# Altium schematic sheet ETH10M100_MAGNET_RJ45.SchDoc
size A3
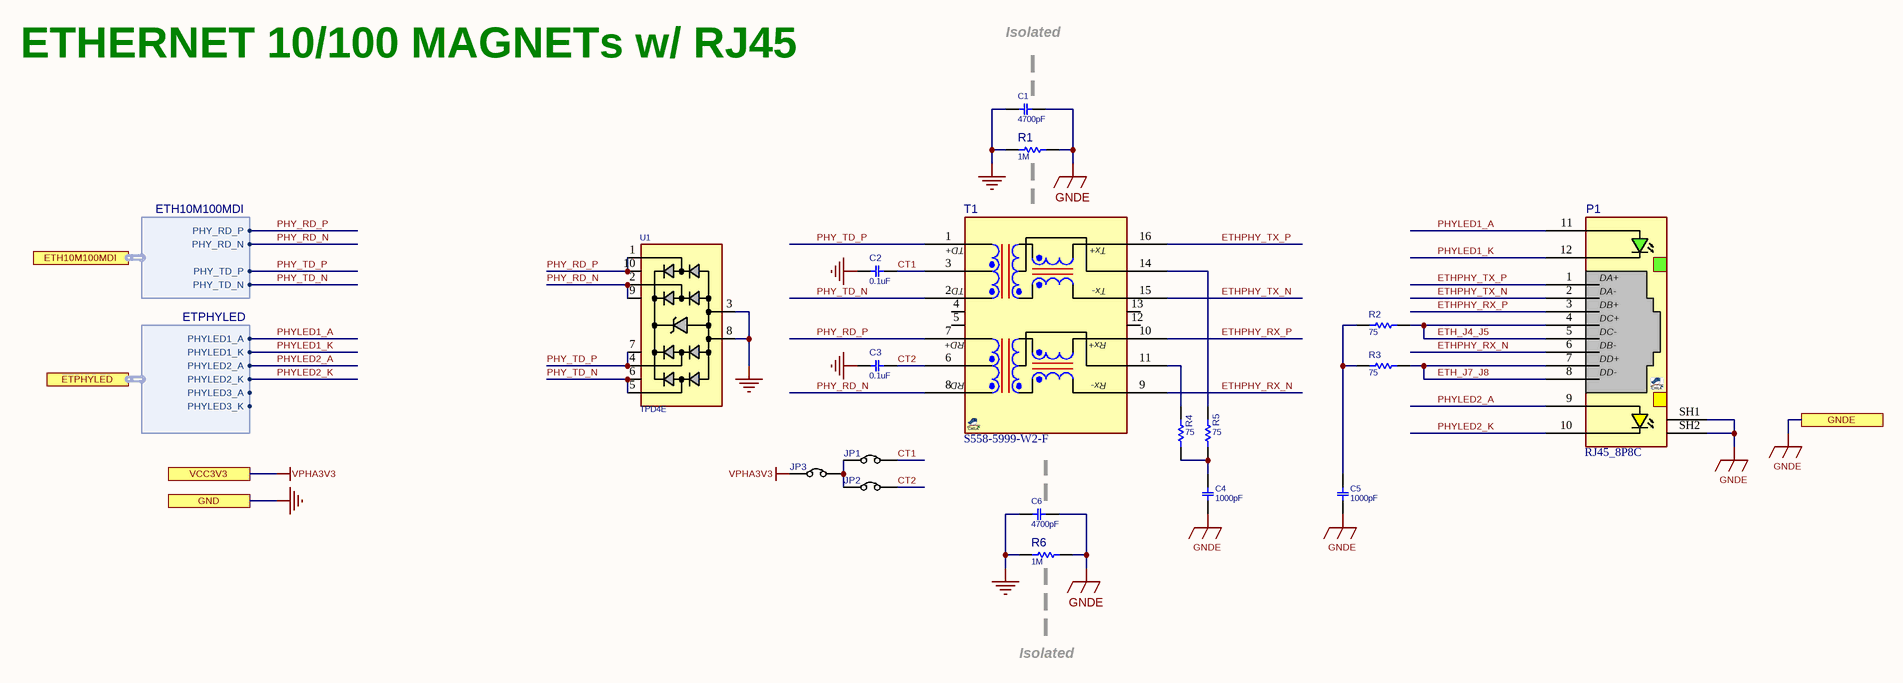
[diagram p0: ETH10M100_MAGNET_RJ45.SchDoc]

## Parts
C1  4700pF  [C1206]
C2  0.1uF  [C0402]
C3  0.1uF  [C0402]
C4  1000pF  [C1206]
C5  1000pF  [C1206]
C6  4700pF  [C1206]
JP1  JMPSOLDER  [JP_30X50]  (value not drawn)
JP2  JMPSOLDER  [JP_30X50]  (value not drawn)
JP3  JMPSOLDER  [JP_30X50]  (value not drawn)
P1  RJ45_8P8C  [RJ45_8S_RA_TU_L]
R1  1M  [R2512]
R2  75  [R0603O]
R3  75  [R0603O]
R4  75  [R0603O]
R5  75  [R0603O]
R6  1M  [R2512]
T1  S558-5999-W2-F  [SO_16_7W6H]
U1  TPD4E  [SON50_10_2510]

## Ports
ETH10M100MDI (harness ETH10M100MDI), ETPHYLED (harness ETPHYLED), GND, GNDE, VCC3V3

## Harnesses
ETH10M100MDI: PHY_RD_P, PHY_RD_N, PHY_TD_P, PHY_TD_N
ETPHYLED: PHYLED1_A, PHYLED1_K, PHYLED2_A, PHYLED2_K, PHYLED3_A, PHYLED3_K

## Nets
GND: C1.1 C2.1 C3.1 C6.1 R1.2 R6.2 U1.3 U1.8 ; port GND
GNDE: C1.2 C4.2 C5.2 C6.2 P1.SH1 P1.SH2 R1.1 R6.1 ; port GNDE
VPHA3V3: JP3.1 ; port VCC3V3
CT1: C2.2 JP1.2 T1.3(TDCT)
CT2: C3.2 JP2.2 T1.6(RDCT)
ETH_J4_J5: P1.4(DC+) P1.5(DC-) R2.2
ETH_J7_J8: P1.7(DD+) P1.8(DD-) R3.2
ETHPHY_RX_N: P1.6(DB-) T1.9(RX-)
ETHPHY_RX_P: P1.3(DB+) T1.10(RX+)
ETHPHY_TX_N: P1.2(DA-) T1.15(TX-)
ETHPHY_TX_P: P1.1(DA+) T1.16(TX+)
PHY_RD_N: T1.8(RD-) U1.2 U1.9 ; port ETH10M100MDI.PHY_RD_N
PHY_RD_P: T1.7(RD+) U1.1 U1.10 ; port ETH10M100MDI.PHY_RD_P
PHY_TD_N: T1.2(TD-) U1.5 U1.6 ; port ETH10M100MDI.PHY_TD_N
PHY_TD_P: T1.1(TD+) U1.4 U1.7 ; port ETH10M100MDI.PHY_TD_P
PHYLED1_A: P1.11(GLED+) ; port ETPHYLED.PHYLED1_A
PHYLED1_K: P1.12(GLED-) ; port ETPHYLED.PHYLED1_K
PHYLED2_A: P1.9(YLED+) ; port ETPHYLED.PHYLED2_A
PHYLED2_K: P1.10(YLED-) ; port ETPHYLED.PHYLED2_K
NetC4_1: C4.1 R4.2 R5.2
NetC5_1: C5.1 R2.1 R3.1
NetJP1_1: JP1.1 JP2.1 JP3.2
NetR4_1: R4.1 T1.11(RXCT)
NetR5_1: R5.1 T1.14(TXCT)

Not connected (* = marked no-connect by the designer): T1 4(NC_1) 5(NC_2) 12(NC_3) 13(NC_4)

## Notes on the sheet
- ETHERNET 10/100 MAGNETs w/ RJ45
- Isolated
- (in symbol S558-5999-W2-F_SO16) Tx+; Tx-; Rx+; Rx-

## Library data of the parts
C1 C6 = CAP_SMD_MLCC_68n1kv: CAP, MLCC; MANF_P#: NV1206B472K202CEGN; MANF: KEMET; PARAM: X7R, 10%, -55~125oC; PARAM2: 2000V; PRICE: $0.03; VALUE: 4700pF
C2 C3 = CAP_SMD_MLCC_22n50V: CAP, MLCC; PARAM2: 50V; MANF_P#: -; MANF: -; PARAM: -; DESC: -; VALUE: 0.1uF
C4 C5 = CAP_SMD_MLCC_22n50V: CAP, MLCC; MANF_P#: 1206B102K202NT; PARAM2: 2kV; MANF: -; PARAM: -; DESC: -; PRICE: $0.006; VALUE: 1000pF
JP1-JP3 = JUMPER_SOLDER: JUMPER, HEADER 2PIN; MANF: MANF; MANF_P#: MANF_P#; VALUE: JMPSOLDER
P1 = RJ45_8S_RA_TU_L: RJ45, 8P+LED, SHIELDED, RightAngle, TabUP; MANF: WURTH; MANF_P#: 615008137421; PRICE: 1.2$; VALUE: RJ45_8P8C
R1 R6 = RES_SMD: RESISTOR, SMD; PARAM: 1W; DESC: DESCRIPTION; MANF_P#: FRC2512J105 TS; MANF: -; ASSEMBLY: ASSEMBLY; PRICE: $0.02; DIST#: -; PARAM2: -; VALUE: 1M
R2-R5 = RES_SMD_1K_0402YK: RESISTOR, SMD, THICK FILM, YAGEO; MANF_P#: RC0402FR-071KL; PARAM: 0.063W; DESC: DESCRIPTION; DIST#: MOUSER; PARAM2: 1%; MANF: Yageo; ASSEMBLY: ASSEMBLY; PRICE: 100= 0.3$; VALUE: 75
T1 = S558-5999-W2-F_SO16: Transformer, LAN, 10/100 Base-T, 1CT:1CT, 350uH; MANF: Bel; PARAM2: 1CT:1CT, 350uH, -40~85°C; MANF_P#: S558-5999-W2-F; PARAM: LAN, 10/100 Base-T; PRICE: 2$; VALUE: S558-5999-W2-F
U1 = TVS_X4_TPD4E05U06: TVS, ESD PROTECT, 4CH,; MANF_P#: TPD4E05U06DQA; MANF: Texas Instruments; PARAM2: 6.5Vbr, 0.4pF, –40°~125°C; PARAM: ±12-kV ContactD, ±15-kVAirD; PRICE: 0.6$; VALUE: TPD4E